# Altium schematic sheet PyBoard_PCB.SchDoc
size A2
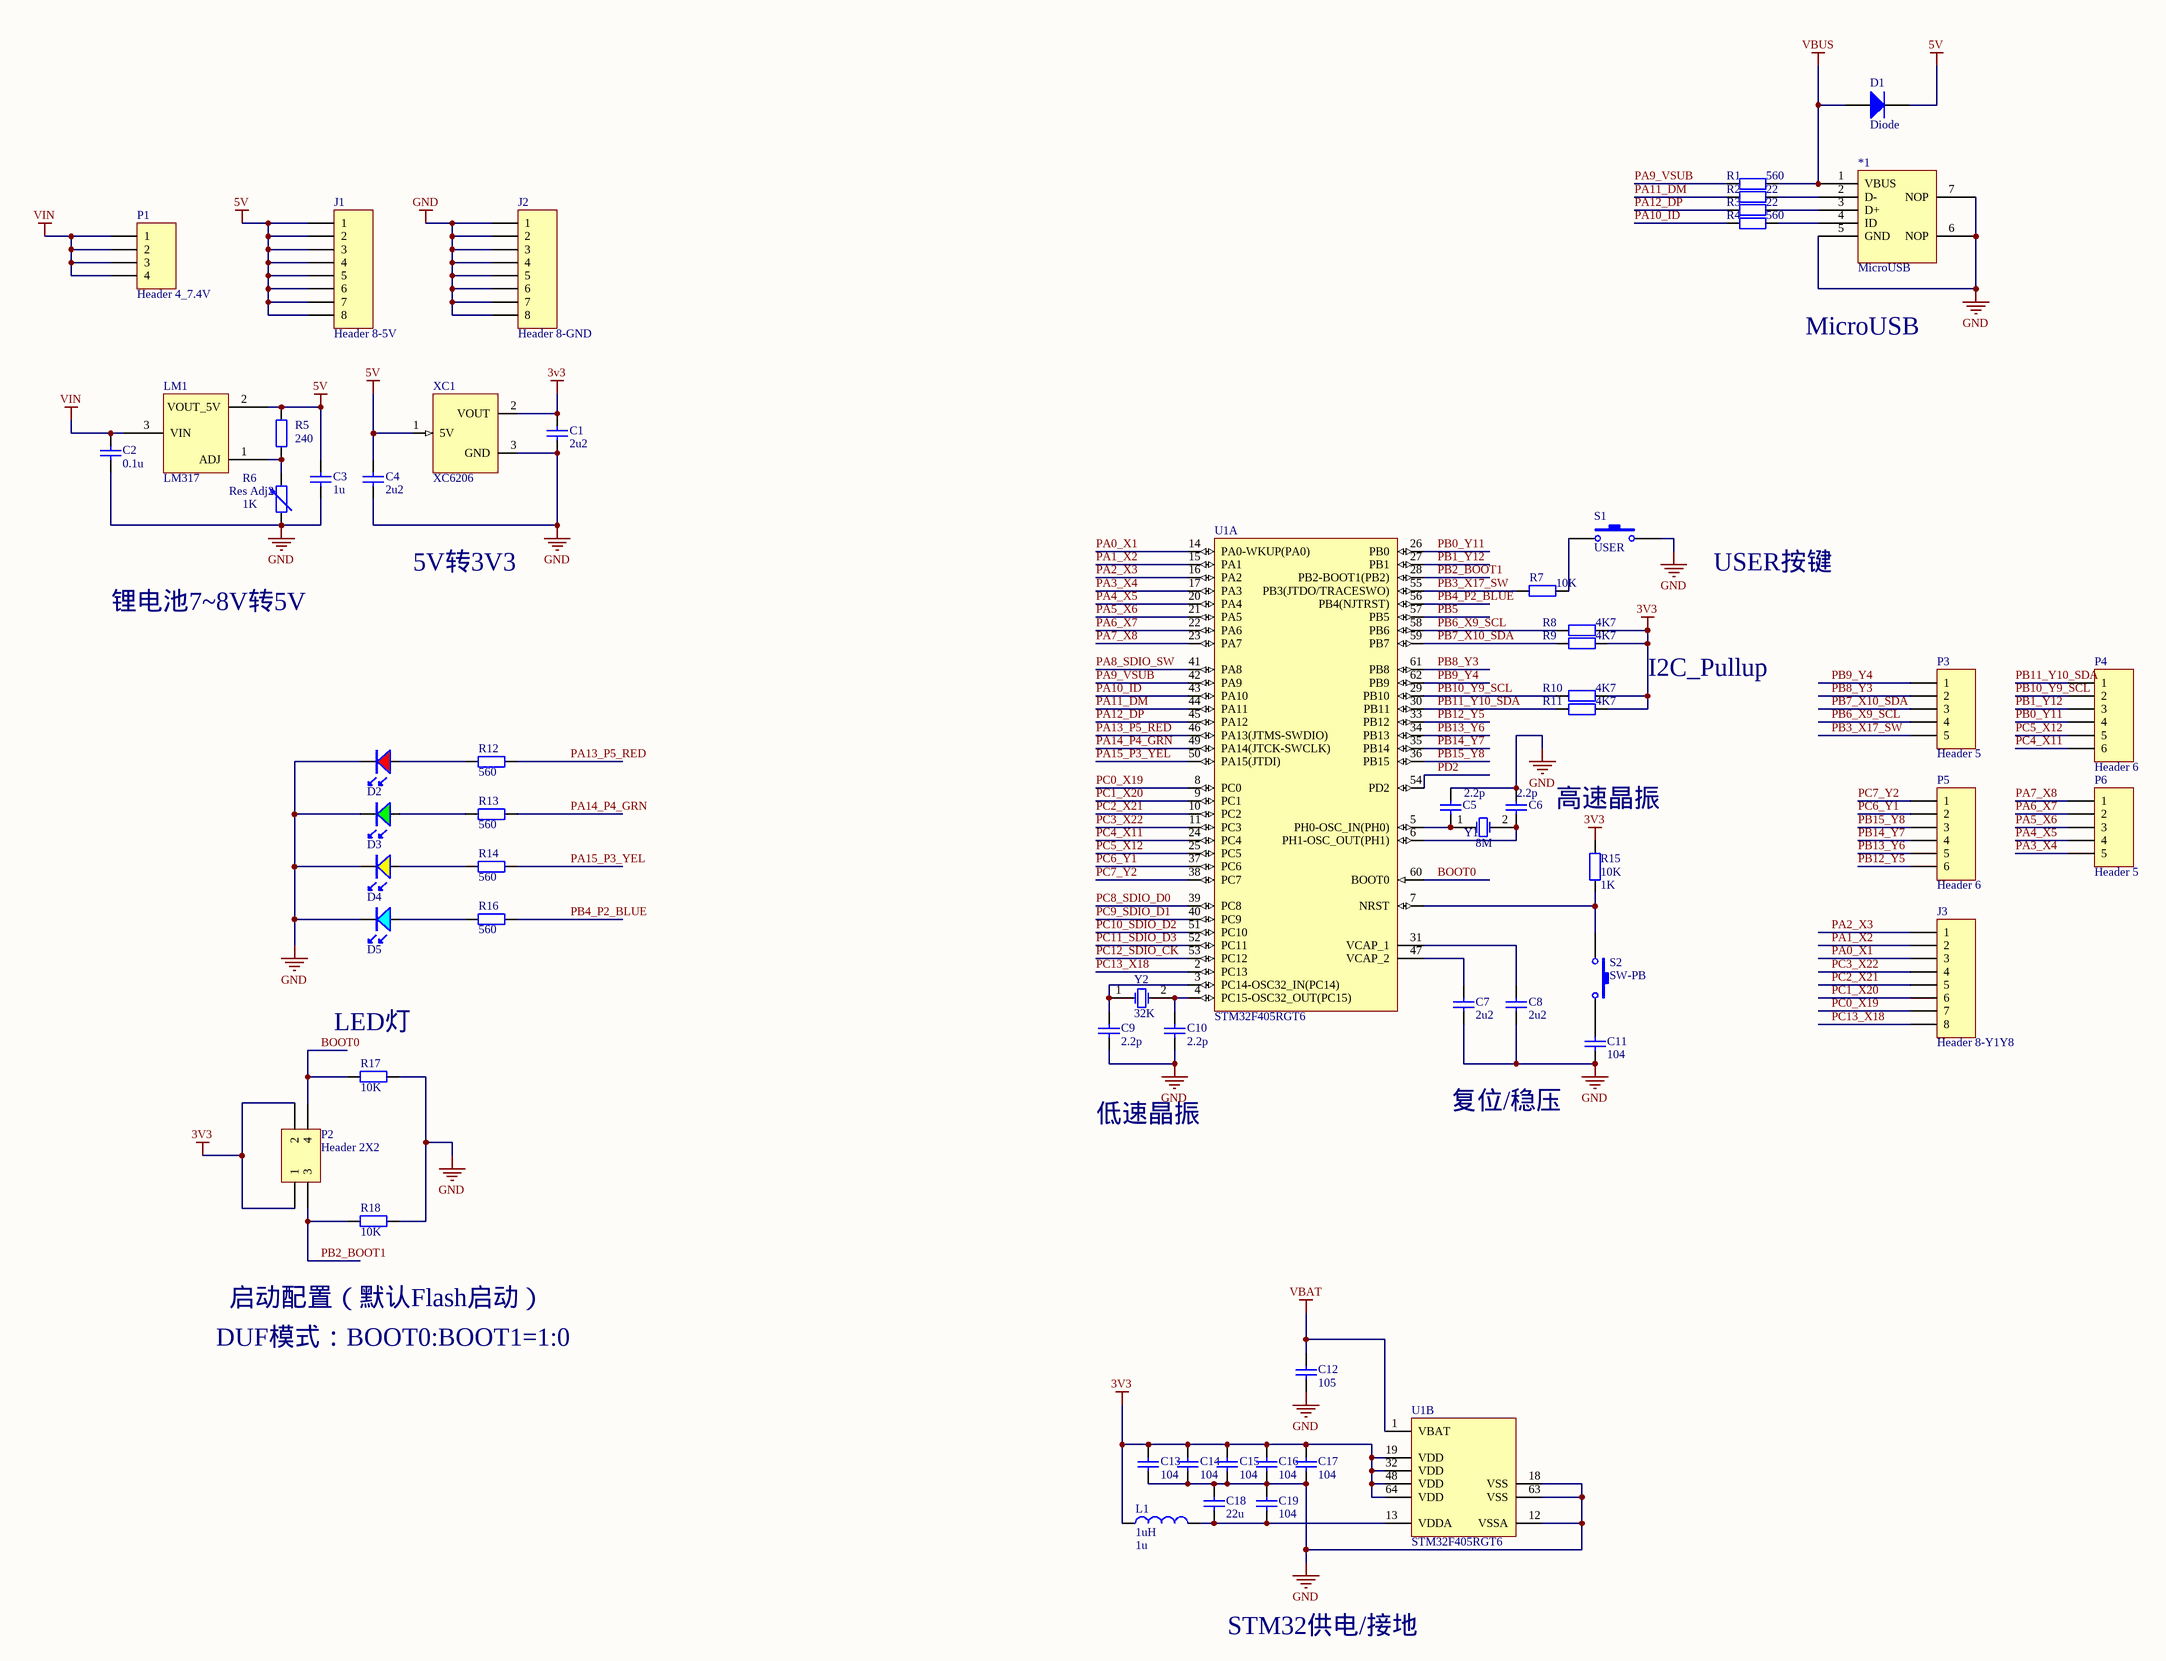
[diagram p0: PyBoard_PCB.SchDoc]

## Parts
*1  MicroUSB  [MicroUSB]
C1  2u2  [SMD0603]
C2  0.1u  [SMD0603]
C3  1u  [SMD0603]
C4  2u2  [SMD0603]
C5  2.2p  [SMD0603]
C6  2.2p  [SMD0603]
C7  2u2  [SMD0603]
C8  2u2  [SMD0603]
C9  2.2p  [SMD0603]
C10  2.2p  [SMD0603]
C11  104  [SMD0603]
C12  105  [SMD0603]
C13  104  [SMD0603]
C14  104  [SMD0603]
C15  104  [SMD0603]
C16  104  [SMD0603]
C17  104  [SMD0603]
C18  22u  [SMD0603]
C19  104  [SMD0603]
D1  Diode  [SS24 - small]
D2  LED RED  [LED0603]  (value not drawn)
D3  LED GREEN  [LED0603]  (value not drawn)
D4  LED Yellow  [LED0603]  (value not drawn)
D5  LED Blue  [LED0603]  (value not drawn)
J1  Header 8-5V  [HDR1X8]
J2  Header 8-GND  [HDR1X8]
J3  Header 8-Y1Y8  [HDR1X8]
L1  1uH  value 1u  [SMD0603]
LM1  LM317  [TO-220AB]
P1  Header 4_7.4V  [HDR1X4]
P2  Header 2X2  [HDR2X2]
P3  Header 5  [HDR1X5]
P4  Header 6  [HDR1X6]
P5  Header 6  [HDR1X6]
P6  Header 5  [HDR1X5]
R1  560  [SMD0603]
R2  22  [SMD0603]
R3  22  [SMD0603]
R4  560  [SMD0603]
R5  240  [SMD0603]
R6  Res Adj2  value 1K  [AXIAL-0.6]
R7  10K  [SMD0603]
R8  4K7  [SMD0603]
R9  4K7  [SMD0603]
R10  4K7  [SMD0603]
R11  4K7  [SMD0603]
R12  560  [SMD0603]
R13  560  [SMD0603]
R14  560  [SMD0603]
R15  10K  value 1K  [SMD0603]
R16  560  [SMD0603]
R17  10K  [SMD0603]
R18  10K  [SMD0603]
S1  USER  [SW 3X6]
S2  SW-PB  [SW 3X6]
U1  STM32F405RGT6  [LQFP64_M]  (parts A,B of 2)
XC1  XC6206  [SOT-23_N]
Y1  8M  [TXC_9H03200019]
Y2  32K  [TXC_9H03200019]

## Nets
3V3: C1.2 C13.2 C14.2 C15.2 C16.2 C17.2 L1.1 P2.1 P2.2 R8.1 R9.1 R10.1 R11.1 R15.2 U1.19(VDD) U1.32(VDD) U1.48(VDD) U1.64(VDD) XC1.2(VOUT)
5V: C3.2 C4.2 D1.2(K) J1.1 J1.2 J1.3 J1.4 J1.5 J1.6 J1.7 J1.8 LM1.2(VOUT_5V) R5.2 XC1.1(5V)
GND: *1.5(GND) *1.6(NOP) *1.7(NOP) C1.1 C2.1 C3.1 C4.1 C5.2 C6.2 C7.1 C8.1 C9.1 C10.1 C11.1 C12.1 C13.1 C14.1 C15.1 C16.1 C17.1 C18.2 C19.2 D2.2 D3.2 D4.2 D5.2 J2.1 J2.2 J2.3 J2.4 J2.5 J2.6 J2.7 J2.8 R6.1 R17.2 R18.2 S1.2 U1.12(VSSA) U1.18(VSS) U1.63(VSS) XC1.3(GND)
VBAT: C12.2 U1.1(VBAT)
VBUS: *1.1(VBUS) D1.1(A) R1.2
VIN: C2.2 LM1.3(VIN) P1.1 P1.2 P1.3 P1.4
BOOT0: P2.4 R17.1 U1.60(BOOT0)
PA0_X1: J3.3 U1.14(PA0-WKUP(PA0))
PA1_X2: J3.2 U1.15(PA1)
PA2_X3: J3.1 U1.16(PA2)
PA3_X4: P6.5 U1.17(PA3)
PA4_X5: P6.4 U1.20(PA4)
PA5_X6: P6.3 U1.21(PA5)
PA6_X7: P6.2 U1.22(PA6)
PA7_X8: P6.1 U1.23(PA7)
PA8_SDIO_SW: U1.41(PA8)
PA9_VSUB: R1.1 U1.42(PA9)
PA10_ID: R4.1 U1.43(PA10)
PA11_DM: R2.1 U1.44(PA11)
PA12_DP: R3.1 U1.45(PA12)
PA13_P5_RED: R12.2 U1.46(PA13(JTMS-SWDIO))
PA14_P4_GRN: R13.2 U1.49(PA14(JTCK-SWCLK))
PA15_P3_YEL: R14.2 U1.50(PA15(JTDI))
PB0_Y11: P4.4 U1.26(PB0)
PB1_Y12: P4.3 U1.27(PB1)
PB2_BOOT1: P2.3 R18.1 U1.28(PB2-BOOT1(PB2))
PB3_X17_SW: P3.5 R7.2 U1.55(PB3(JTDO/TRACESWO))
PB4_P2_BLUE: R16.2 U1.56(PB4(NJTRST))
PB5: U1.57(PB5)
PB6_X9_SCL: P3.4 R8.2 U1.58(PB6)
PB7_X10_SDA: P3.3 R9.2 U1.59(PB7)
PB8_Y3: P3.2 U1.61(PB8)
PB9_Y4: P3.1 U1.62(PB9)
PB10_Y9_SCL: P4.2 R10.2 U1.29(PB10)
PB11_Y10_SDA: P4.1 R11.2 U1.30(PB11)
PB12_Y5: P5.6 U1.33(PB12)
PB13_Y6: P5.5 U1.34(PB13)
PB14_Y7: P5.4 U1.35(PB14)
PB15_Y8: P5.3 U1.36(PB15)
PC0_X19: J3.7 U1.8(PC0)
PC1_X20: J3.6 U1.9(PC1)
PC2_X21: J3.5 U1.10(PC2)
PC3_X22: J3.4 U1.11(PC3)
PC4_X11: P4.6 U1.24(PC4)
PC5_X12: P4.5 U1.25(PC5)
PC6_Y1: P5.2 U1.37(PC6)
PC7_Y2: P5.1 U1.38(PC7)
PC8_SDIO_D0: U1.39(PC8)
PC9_SDIO_D1: U1.40(PC9)
PC10_SDIO_D2: U1.51(PC10)
PC11_SDIO_D3: U1.52(PC11)
PC12_SDIO_CK: U1.53(PC12)
PC13_X18: J3.8 U1.2(PC13)
PD2: U1.54(PD2)
Net*1_2: *1.2(D-) R2.2
Net*1_3: *1.3(D+) R3.2
Net*1_4: *1.4(ID) R4.2
NetC5_1: C5.1 U1.5(PH0-OSC_IN(PH0)) Y1.1(OSC1)
NetC6_1: C6.1 U1.6(PH1-OSC_OUT(PH1)) Y1.2(OSC2)
NetC7_2: C7.2 U1.47(VCAP_2)
NetC8_2: C8.2 U1.31(VCAP_1)
NetC9_2: C9.2 U1.3(PC14-OSC32_IN(PC14)) Y2.1(OSC1)
NetC10_2: C10.2 U1.4(PC15-OSC32_OUT(PC15)) Y2.2(OSC2)
NetC11_2: C11.2 S2.2
NetC18_1: C18.1 C19.1 L1.2 U1.13(VDDA)
NetD2_1: D2.1 R12.1
NetD3_1: D3.1 R13.1
NetD4_1: D4.1 R14.1
NetD5_1: D5.1 R16.1
NetLM1_1: LM1.1(ADJ) R5.1 R6.2
NetR7_1: R7.1 S1.1
NetR15_1: R15.1 S2.1 U1.7(NRST)

## Notes on the sheet
- MicroUSB
- 5V转3V3
- USER按键
- 锂电池7~8V转5V
- I2C_Pullup
- 高速晶振
- (near R17) LED灯
- 复位/稳压
- 低速晶振
- 启动配置（默认Flash启动）
- DUF模式：BOOT0:BOOT1=1:0
- STM32供电/接地
- Title
- Size:
- Date:
- A3
- Number:
- Time:
- Revision:
- Sheet
- of
- File:

## Library data of the parts
C1 C4-C19 = Cap: Capacitor; Published: 8-Jun-2000; LatestRevisionDate: 17-Jul-2002; LatestRevisionNote: Re-released for DXP Platform.; PackageReference: RAD-0.3; Publisher: Altium Limited
  C1 C4: Value: 2u2
C2 C3 = Cap: Capacitor; Value: 2u2; Published: 8-Jun-2000; LatestRevisionDate: 17-Jul-2002; LatestRevisionNote: Re-released for DXP Platform.; PackageReference: RAD-0.3; Publisher: Altium Limited
D1 = Diode: Default Diode; Published: 8-Jun-2000; LatestRevisionDate: 17-Jul-2002; LatestRevisionNote: Re-released for DXP Platform.; PackageDocument: Sep-1996; PackageReference: SMC; Publisher: Altium Limited; Code_JEDEC: DO-214-AB
D2 = LED-RED: 红色发光二极管
D3 = LED-GREEN: 绿色发光二极管
D4 = LED-YELLOW: 黄色发光二极管
D5 = LED-BLUE: 蓝色发光二极管
J1-J3 = Header 8: Header, 8-Pin; LatestRevisionDate: 17-Jul-2002; LatestRevisionNote: Re-released for DXP Platform.; Publisher: Altium Limited
L1 = Inductor: Code_IEC: 1005; Published: 8-Jun-2000; LatestRevisionDate: 17-Jul-2002; LatestRevisionNote: Re-released for DXP Platform.; PackageReference: 0402-A; Publisher: Altium Limited; Code_JEITA: 0402
P1 = Header 4: Header, 4-Pin; LatestRevisionDate: 17-Jul-2002; LatestRevisionNote: Re-released for DXP Platform.; Publisher: Altium Limited
P2 = Header 2X2: Header, 2-Pin, Dual row; LatestRevisionDate: 17-Jul-2002; LatestRevisionNote: Re-released for DXP Platform.; Publisher: Altium Limited
P3 P6 = Header 5: Header, 5-Pin; LatestRevisionDate: 17-Jul-2002; LatestRevisionNote: Re-released for DXP Platform.; Publisher: Altium Limited
P4 P5 = Header 6: Header, 6-Pin; LatestRevisionDate: 17-Jul-2002; LatestRevisionNote: Re-released for DXP Platform.; Publisher: Altium Limited
R1-R4 R7-R16 = Res: Resistor; Published: 8-Jun-2000; LatestRevisionDate: 17-Jul-2002; LatestRevisionNote: Re-released for DXP Platform.; PackageReference: AXIAL-0.4; Publisher: Altium Limited
  R1 R4 R12-R14 R16: Value: 560
  R2 R3: Value: 22
R5 R17 R18 = Res: Resistor; Value: 560; Published: 8-Jun-2000; LatestRevisionDate: 17-Jul-2002; LatestRevisionNote: Re-released for DXP Platform.; PackageReference: AXIAL-0.4; Publisher: Altium Limited
R6 = Res Adj2: Variable Resistor; Set Position: 0.5; Published: 8-Jun-2000; LatestRevisionDate: 17-Jul-2002; LatestRevisionNote: Re-released for DXP Platform.; PackageReference: AXIAL-0.6; Publisher: Altium Limited
S1 S2 = SW-PB: Switch; Published: 24-Mar-1999; LatestRevisionDate: 17-Jul-2002; LatestRevisionNote: Re-released for DXP Platform.; PackageReference: SPST-2; Publisher: Altium Limited
U1 = STM32F405RGT6: ARM Cortex-M4 32-bit MCU+FPU, 210 DMIPS, 1024 kB Flash, 192 kB Internal RAM, 51 I/Os, 64-pin LQFP, -40 to 85 degC, Tray; Manufacturer: STMicroelectronics; D/A Converter: 2x12-bit; FLASH Size (Prog) (kB): 1024; I/Os (High Current): 51; Internal RAM Size (kB): 192; Operating Frequency(F) (Processor speed) (MHz): 168; Supply Voltage(Vcc) max (V): 3.6; Supply Voltage(Vcc) min (V): 1.8; DatasheetVersion: Rev. 4; PackageVersion: Rev. 4, 06/2013; PackageReference: LQFP64; PackageDescription: 64-Pin Low Profile Quad Flat Package, 10 x 10 mm Body, 0.5 mm Pitch; Supplier 1: Digi-Key; Supplier Part Number 1: 497-11767-ND; Supplier 2: Farnell; Supplier Part Number 2: 2064363; Supplier 3: Newark; Supplier Part Number 3: 73T2329; Supplier 4: Mouser; Supplier Part Number 4: 511-STM32F405RGT6; Core: ARM Cortex-M4; Packing: Tray; Mounting Technology: Surface Mount; PartNumber: STM32F405RGT6; ComponentLink1Description: Manufacturer URL; ComponentLink1URL: http://www.st.com/web/en/home.html; ComponentLink2Description: Datasheet; ComponentLink2URL: http://www.st.com/st-web-ui/static/active/en/resource/technical/document/datasheet/DM00037051.pdf; ComponentLink3Description: Package Specification; ComponentLink3URL: http://www.st.com/st-web-ui/static/active/en/resource/technical/document/datasheet/DM00037051.pdf
Y1 Y2 = XTAL: Crystal Oscillator; Published: 8-Jun-2000; LatestRevisionDate: 17-Jul-2002; LatestRevisionNote: Re-released for DXP Platform.; PackageReference: R38; Publisher: Altium Limited